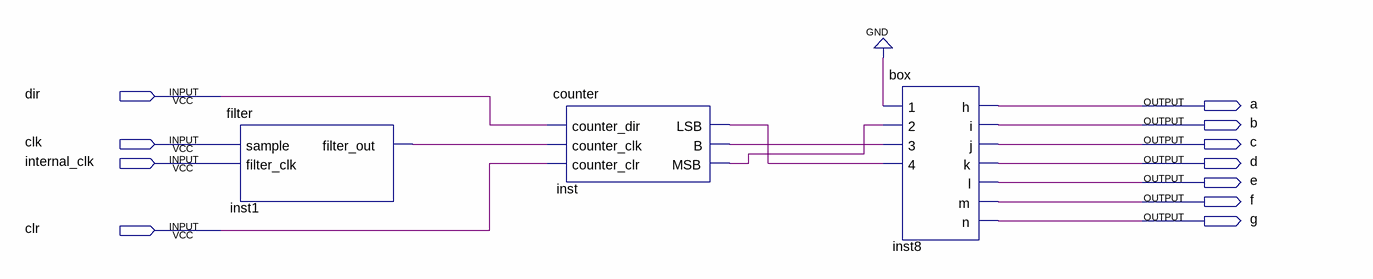
[diagram p0: schematic sheet]
// Quartus schematic bcd.bdf as structural Verilog: 3 symbols, 11 pins
module bcd (
  input  dir,
  input  clk,
  input  internal_clk,
  input  clr,
  output a,
  output b,
  output c,
  output d,
  output e,
  output f,
  output g
);

  wire inst1_filter_out, inst_b, inst_lsb, inst_msb;

  filter inst1 (.sample(clk), .filter_clk(internal_clk), .filter_out(inst1_filter_out));
  counter inst (
    .counter_dir(dir), .counter_clk(inst1_filter_out), .counter_clr(clr), .LSB(inst_lsb), .B(inst_b),
    .MSB(inst_msb));
  box inst8 (.\1 (1'b0), .\2 (inst_msb), .\3 (inst_b), .\4 (inst_lsb), .h(a), .i(b), .j(c), .k(d), .l(e), .m(f), .n(g));
endmodule
